# Altium schematic sheet Interface.SchDoc
size A4
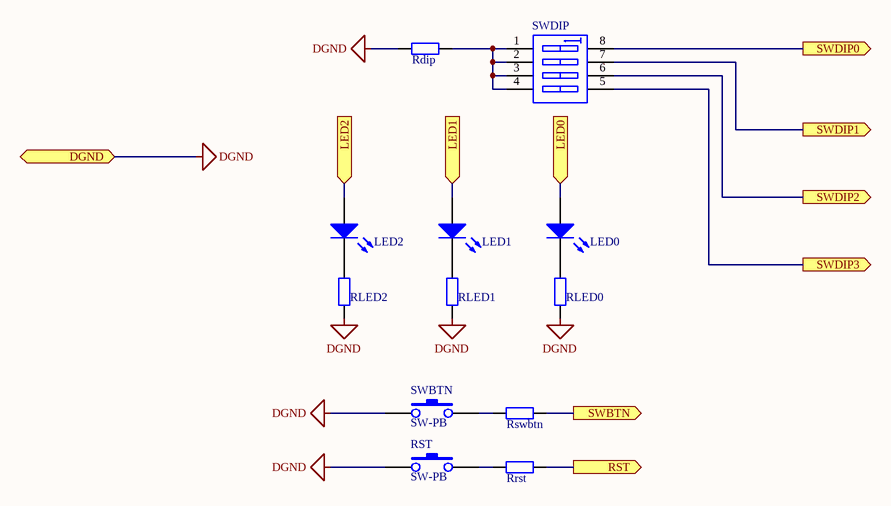
[diagram p0: Interface.SchDoc]

## Parts
LED0  LTST-C170KGKT  [ECE-LED2012-0805SM]  (value not drawn)
LED1  LTST-C170KAKT  [ECE-LED2012-0805SM]  (value not drawn)
LED2  LTST-C170KAKT  [ECE-LED2012-0805SM]  (value not drawn)
Rdip  1K  [ECE-RESC2012-0805SM]  (value not drawn)
RLED0  270R  [ECE-RESC1608-0603SM]  (value not drawn)
RLED1  270R  [ECE-RESC1608-0603SM]  (value not drawn)
RLED2  270R  [ECE-RESC1608-0603SM]  (value not drawn)
Rrst  1K  [ECE-RESC1608-0603SM]  (value not drawn)
RST  SW-PB  [SW-PB]
Rswbtn  1K  [ECE-RESC1608-0603SM]  (value not drawn)
SWBTN  SW-PB  [SW-PB]
SWDIP  *  [ECE-DIP8]  (value not drawn)

## Ports
DGND (bidir), LED0 (in), LED1 (in), LED2 (in), RST (out), SWBTN (out), SWDIP0 (out), SWDIP1 (out), SWDIP2 (out), SWDIP3 (out)

## Nets
DGND: Rdip.1 RLED0.1 RLED1.1 RLED2.1 RST.1 SWBTN.1 ; port DGND
LED0: LED0.1(A) ; port LED0
LED1: LED1.1(A) ; port LED1
LED2: LED2.1(A) ; port LED2
RST: Rrst.2 ; port RST
SWBTN: Rswbtn.2 ; port SWBTN
SWDIP0: SWDIP.8(B1) ; port SWDIP0
SWDIP1: SWDIP.7(B2) ; port SWDIP1
SWDIP2: SWDIP.6(B3) ; port SWDIP2
SWDIP3: SWDIP.5(B4) ; port SWDIP3
NetLED0_2: LED0.2(K) RLED0.2
NetLED1_2: LED1.2(K) RLED1.2
NetLED2_2: LED2.2(K) RLED2.2
NetRdip_2: Rdip.2 SWDIP.1(A1) SWDIP.2(A2) SWDIP.3(A3) SWDIP.4(A4)
NetRrst_1: Rrst.1 RST.2
NetRswbtn_1: Rswbtn.1 SWBTN.2

## Library data of the parts
LED0 = DIO000104: LED GREEN CLEAR 0805 SM; Manufactuer: Lite-On Inc; Assembly Method: Surface Mount; Voltage/Current: 20mA; Item Type: Item; Path: ece/ts/Lists/Stock Inventory; UoA Stock#: DIO000104; Value: LTST-C170KGKT; Size/Package: 0805 (2012 Metric); Manufacturer-PN: LTST-C170KGKT; Datasheet Link: http://share.engineering.auckland.ac.nz/ece/ts/Student%20Documents/LED-S_110_LTST-C170KGKT.pdf; Supplier1: Digikey; Supplier1-PN: 160-1414-6-ND; Component Type: LED-0805-GREEN; Category: Diode; Status: Active
LED1 LED2 = DIO000105: LED RED ORANGE CLEAR 0805 SMD; Manufactuer: Lite-On Inc; Assembly Method: Surface Mount; Voltage/Current: 20mA; Item Type: Item; Path: ece/ts/Lists/Stock Inventory; UoA Stock#: DIO000105; Value: LTST-C170KAKT; Size/Package: 0805 (2012 Metric); Manufacturer-PN: LTST-C170KAKT; Datasheet Link: http://share.engineering.auckland.ac.nz/ece/ts/Student%20Documents/LED-S_110_LTST-C170KAKT.pdf; Supplier1: Digikey; Supplier1-PN: 160-1412-6-ND; Component Type: LED-0805-RED; Category: Diode; Status: Active
Rdip = RES000538: RES CER 1K 2012 SM; Manufactuer: Yageo; Manufacturer-PN: RC0805FR-071KL; Assembly Method: Surface Mount; Voltage/Current: 1/8W; Item Type: Item; Path: ece/ts/Lists/Stock Inventory; Value: 1K; UoA Stock#: RES000538; Size/Package: 2012 (0805); Supplier1: Digikey; Supplier1-PN: 311-1.00KCRTR-ND; Component Type: RES-2012-1K; Category: Resistor; Status: Active; Datasheet Link: http://share.engineering.auckland.ac.nz/ece/ts/Student%20Documents/Yageo-Resistors.pdf
RLED0-RLED2 = RES000131: RES CER 270R 1608 SM; Assembly Method: Surface Mount; Voltage/Current: 1/10W; Item Type: Item; Path: ece/ts/Lists/Stock Inventory; Value: 270R; UoA Stock#: RES000131; Size/Package: 1608 (0603); Component Type: RES-1608-270R; Category: Resistor; Status: Active
Rrst Rswbtn = RES000138: RES CER 1K 1608 SM; Manufactuer: Panasonic; Manufacturer-PN: ERJ-3EKF1001V; Assembly Method: Surface Mount; Voltage/Current: 1/10W; Item Type: Item; Path: ece/ts/Lists/Stock Inventory; Value: 1K; UoA Stock#: RES000138; Size/Package: 1608 (0603); Supplier1: Digikey; Supplier1-PN: P1.00KHTR-ND; Component Type: RES-1608-1K; Category: Resistor; Status: Active; Datasheet Link: http://share.engineering.auckland.ac.nz/ece/ts/Student%20Documents/Panasonic-Resistors.pdf
RST SWBTN = SW-PB: Push Button Switch
SWDIP = Switch-DIP8: Value: *